# EAGLE design hexapod_mk2_main_v2.0 (EAGLE 9.6.2)
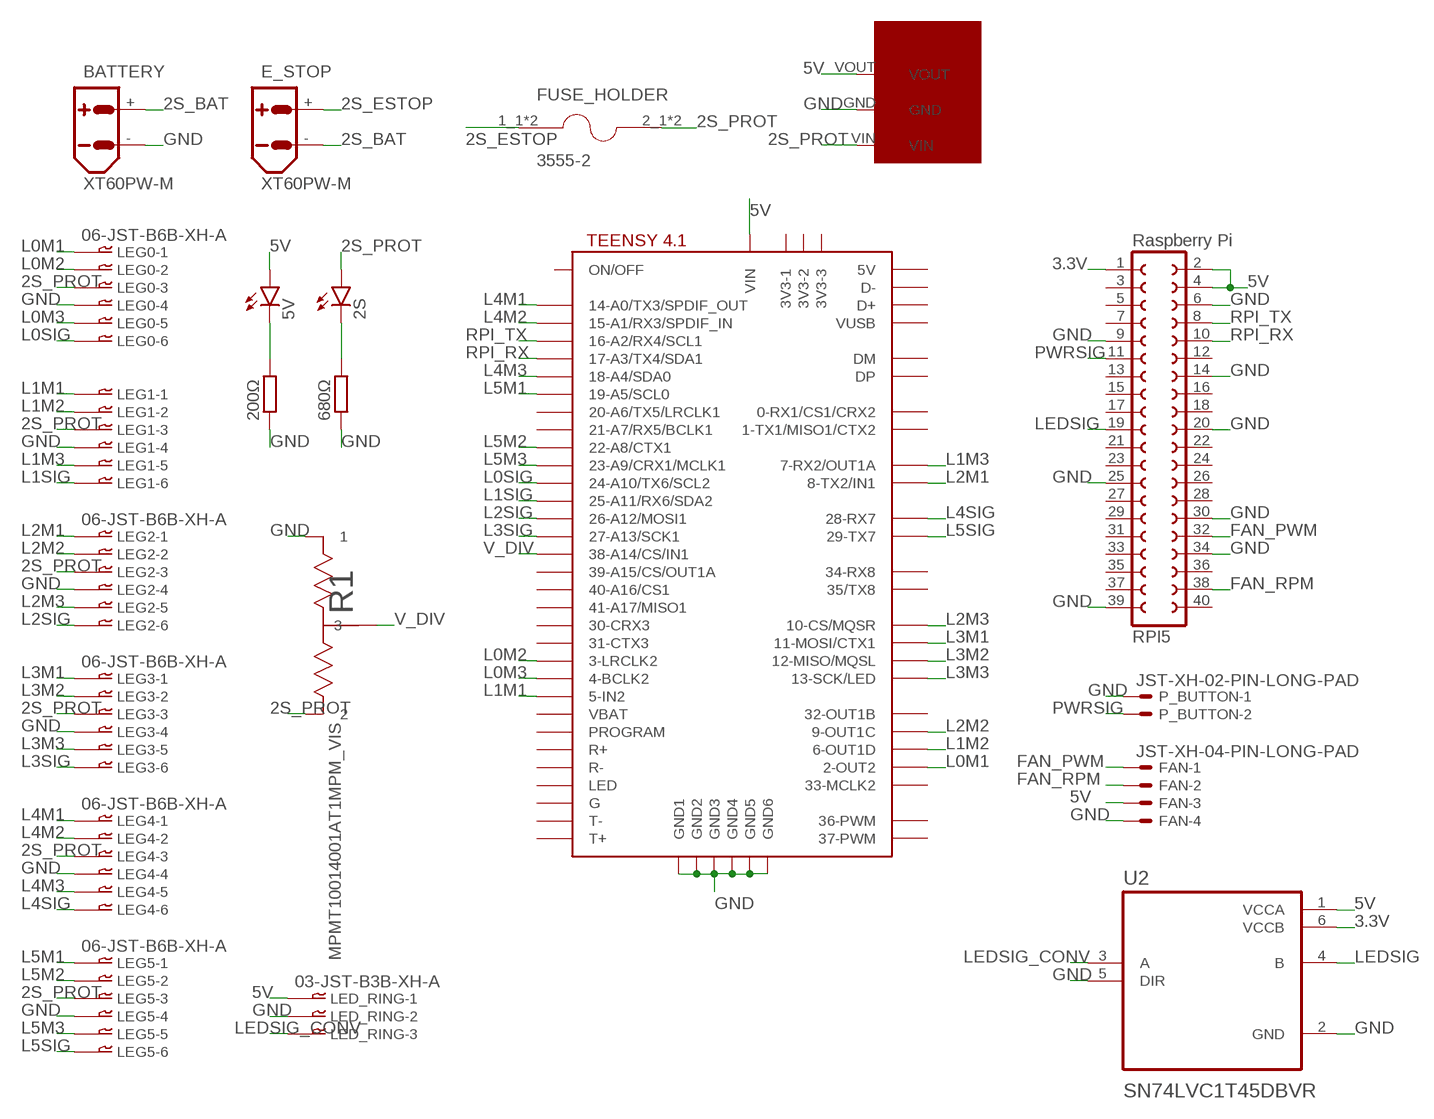
[diagram p0: schematic, sheet 1]

## Parts
2S  LEDCHIPLED_0805  [CHIPLED_0805]
5V  LEDCHIPLED_0805  [CHIPLED_0805]
200Ω  R-EU_R0805  [R0805]
680Ω  R-EU_R0805  [R0805]
BATTERY  XT60PW-M  [XT60PW-M]
DFR0753  DFR0753  [DFR0753]
E_STOP  XT60PW-M  [XT60PW-M]
FAN  JST-XH-04-PIN-LONG-PAD  [JST-XH-04-PACKAGE-LONG-PAD]
FUSE_HOLDER  3555-2  [FUSE_3555-2]
LED_RING  03-JST-B3B-XH-A  [B3B-XH]
LEG0  06-JST-B6B-XH-A  [B6B-XH]
LEG1  06-JST-B6B-XH-A  [B6B-XH]
LEG2  06-JST-B6B-XH-A  [B6B-XH]
LEG3  06-JST-B6B-XH-A  [B6B-XH]
LEG4  06-JST-B6B-XH-A  [B6B-XH]
LEG5  06-JST-B6B-XH-A  [B6B-XH]
P_BUTTON  JST-XH-02-PIN-LONG-PAD  [JST-XH-02-PACKAGE-LONG-PAD]
R1  MPMT10014001AT1MPM_VIS  [MPM_VIS]
RPI5  Raspberry Pi  FE20-2  [FE20-2]
U2  SN74LVC1T45DBVR  [SOT95P280X145-6N]
U$1  TEENSY41  [TEENSY41]

## Nets
2S_BAT: BATTERY.+ E_STOP.-
2S_ESTOP: E_STOP.+ FUSE_HOLDER.1_1 FUSE_HOLDER.1_2
2S_PROT: 2S.A DFR0753.VIN FUSE_HOLDER.2_1 FUSE_HOLDER.2_2 LEG0.P$3 LEG1.P$3 LEG2.P$3 LEG3.P$3 LEG4.P$3 LEG5.P$3 R1.2
3.3V: RPI5.1 U2.6(VCCB)
5V: 5V.A DFR0753.VOUT FAN.3 LED_RING.P$1 RPI5.2 RPI5.4 U2.1(VCCA) U$1.VIN
FAN_PWM: FAN.1 RPI5.32
FAN_RPM: FAN.2 RPI5.38
GND: 200Ω.1 680Ω.1 BATTERY.- DFR0753.GND FAN.4 LED_RING.P$2 LEG0.P$4 LEG1.P$4 LEG2.P$4 LEG3.P$4 LEG4.P$4 LEG5.P$4 P_BUTTON.1 R1.1 RPI5.6 RPI5.9 RPI5.14 RPI5.20 RPI5.25 RPI5.30 RPI5.34 RPI5.39 U2.2(GND) U2.5(DIR) U$1.GND1 U$1.GND2 U$1.GND3 U$1.GND4 U$1.GND5 U$1.GND6
L0M1: LEG0.P$1 U$1.2-OUT2
L0M2: LEG0.P$2 U$1.3-LRCLK2
L0M3: LEG0.P$5 U$1.4-BCLK2
L0SIG: LEG0.P$6 U$1.24-A10/TX6/SCL2
L1M1: LEG1.P$1 U$1.5-IN2
L1M2: LEG1.P$2 U$1.6-OUT1D
L1M3: LEG1.P$5 U$1.7-RX2/OUT1A
L1SIG: LEG1.P$6 U$1.25-A11/RX6/SDA2
L2M1: LEG2.P$1 U$1.8-TX2/IN2(8-TX2/IN1)
L2M2: LEG2.P$2 U$1.9-OUT1C
L2M3: LEG2.P$5 U$1.10-CS\MQSR(10-CS/MQSR)
L2SIG: LEG2.P$6 U$1.26-A12/MOSI1
L3M1: LEG3.P$1 U$1.11-MOSI/CTX1
L3M2: LEG3.P$2 U$1.12-MISO/MQSL
L3M3: LEG3.P$5 U$1.13-SCK/LED
L3SIG: LEG3.P$6 U$1.27-A13/SCK1
L4M1: LEG4.P$1 U$1.14-A0/TX3/SPDIF_OUT
L4M2: LEG4.P$2 U$1.15-A1/RX3/SPDIF_IN
L4M3: LEG4.P$5 U$1.18-A4/SDA0
L4SIG: LEG4.P$6 U$1.28-RX7
L5M1: LEG5.P$1 U$1.19-A5/SCL0
L5M2: LEG5.P$2 U$1.22-A8/CTX1
L5M3: LEG5.P$5 U$1.23-A9/CRX1/MCLK1
L5SIG: LEG5.P$6 U$1.29-TX7
LEDSIG: RPI5.19 U2.4(B)
LEDSIG_CONV: LED_RING.P$3 U2.3(A)
N$1: 5V.C 200Ω.2
N$2: 2S.C 680Ω.2
PWRSIG: P_BUTTON.2 RPI5.11
RPI_RX: RPI5.10 U$1.17-A3/TX4/SDA1
RPI_TX: RPI5.8 U$1.16-A2/RX4/SCL1
V_DIV: R1.3 U$1.38-A14/CS/IN1
Unconnected: RPI5.3 RPI5.5 RPI5.7 RPI5.12 RPI5.13 RPI5.15 RPI5.16 RPI5.17 RPI5.18 RPI5.21 RPI5.22 RPI5.23 RPI5.24 RPI5.26 RPI5.27 RPI5.28 RPI5.29 RPI5.31 RPI5.33 RPI5.35 RPI5.36 RPI5.37 RPI5.40 U$1.0-RX1/CS1/CRX2 U$1.1-TX1/MISO1/CTX2 U$1.3V3-1 U$1.3V3-2 U$1.3V3-3 U$1.20-A6/TX5/LRCLK1 U$1.21-A7/RX5/BCLK1 U$1.30-CRX3 U$1.31-CTX3 U$1.32-OUT1B U$1.33-MCLK2 U$1.34-RX8 U$1.35-TX8(35/TX8) U$1.36-PWM U$1.37-PWM U$1.39-A15/CS/OUT1A U$1.40-A16/CS1 U$1.41-A17/MISO1 U$1.+5V(5V) U$1.D+ U$1.D- U$1.DM U$1.DP U$1.G U$1.LED U$1.ON/OFF U$1.PROGRAM U$1.R+ U$1.R- U$1.T+ U$1.T- U$1.VBAT U$1.VUSB

## Library data of the parts
2S 5V = led:LED: LED OSRAM: - CHIPLED LG R971, LG N971, LY N971, LG Q971, LY Q971, LO R971, LY R971 LH N974, LH R974 LS Q976, LO Q976, LY Q976 LO Q996 - Hyper CHIPLED LW Q18S LB Q993, LB Q99A, LB R99A - SideLED LS A670, LO A670, LY A670, LG A670, LP A670 LB A673, LV A673, LT A673, LW A673 LH A674 LY A675 LS A676, LA A676, LO A676, LY A676, LW A676 LS A679, LY A679, LG A679 - Hyper Micro SIDELED® LS Y876, LA Y876, LO Y876, LY Y876 LT Y87S - SmartLED LW L88C, LW L88S LB L89C, LB L89S, LG L890 LS L89K, LO L89K, LY L89K LS L896, LA L896, LO L896, LY L896 - TOPLED LS T670, LO T670, LY T670, LG T670, LP T670 LSG T670, LSP T670, LSY T670, LOP T670, LYG T670 LG T671, LOG T671, LSG T671 LB T673, LV T673, LT T673, LW T673 LH T674 LS T676, LA T676, LO T676, LY T676, LB T676, LH T676, LSB T676, LW T676 LB T67C, LV T67C, LT T67C, LS T67K, LO T67K, LY T67K, LW E67C LS E67B, LA E67B, LO E67B, LY E67B, LB E67C, LV E67C, LT E67C LW T67C LS T679, LY T679, LG T679 LS T770, LO T770, LY T770, LG T770, LP T770 LB T773, LV T773, LT T773, LW T773 LH T774 LS E675, LA E675, LY E675, LS T675 LS T776, LA T776, LO T776, LY T776, LB T776 LHGB T686 LT T68C, LB T68C - Hyper Mini TOPLED® LB M676 - Mini TOPLED Santana® LG M470 LS M47K, LO M47K, LY M47K Source: http://www.osram.convergy.de LUXEON: - LUMILED® LXK2-PW12-R00, LXK2-PW12-S00, LXK2-PW14-U00, LXK2-PW14-V00 LXK2-PM12-R00, LXK2-PM12-S00, LXK2-PM14-U00 LXK2-PE12-Q00, LXK2-PE12-R00, LXK2-PE12-S00, LXK2-PE14-T00, LXK2-PE14-U00 LXK2-PB12-K00, LXK2-PB12-L00, LXK2-PB12-M00, LXK2-PB14-N00, LXK2-PB14-P00, LXK2-PB14-Q00 LXK2-PR12-L00, LXK2-PR12-M00, LXK2-PR14-Q00, LXK2-PR14-R00 LXK2-PD12-Q00, LXK2-PD12-R00, LXK2-PD12-S00 LXK2-PH12-R00, LXK2-PH12-S00 LXK2-PL12-P00, LXK2-PL12-Q00, LXK2-PL12-R00 Source: www.luxeon.com KINGBRIGHT: KA-3528ASYC Source: www.kingbright.com
200Ω 680Ω = rcl:R-EU_: RESISTOR, European symbol; SPICEPREFIX: R
BATTERY E_STOP = amass:XT60: AMASS XT60 connector Store in Japan AMASS XT60 connector <https://szc.jp/ams-xt60>
DFR0753 = DFR0753:DFR0753
FAN = Rembrandt Electronics - JST XH Connectors v1-0:JST-XH-04-PIN: JST XH Connector 2 Pin Wire to board connector. Pitch: 2,54 mm, (0.100") Number of pins: 4 Created by Rembrandt Electronics www.rembrandtelectronics.com
FUSE_HOLDER = 3555-2:3555-2; MANUFACTURER: Keystone; MAXIMUM_PACKAGE_HEIGHT: 11.6mm; PARTREV: A; SNAPEDA_PN: 3555-2; STANDARD: Manufacturer Recommendations
LED_RING = bt_con-jst-xh:03-JST: JST CONNECTOR
LEG0 LEG1-LEG5 = bt_con-jst-xh:06-JST: JST CONNECTOR
P_BUTTON = Rembrandt Electronics - JST XH Connectors v1-0:JST-XH-02-PIN: JST XH Connector 2 Pin Wire to board connector. Pitch: 2,54 mm, (0.100") Number of pins: 2 Created by Rembrandt Electronics www.rembrandtelectronics.com
R1 = MPMT10014001AT1:MPMT10014001AT1; COPYRIGHT: Copyright (C) 2024 Ultra Librarian. All rights reserved.; MANUFACTURER_PART_NUMBER: MPMT10014001AT1; MFR_NAME: Vishay
RPI5 = con-lsta:FE20-2: FEMALE HEADER; OC_FARNELL: unknown; OC_NEWARK: unknown
U2 = SN74LVC1T45DBVR:SN74LVC1T45DBVR
U$1 = teensy:TEENSY41

## Module RASPBERRYPI_PINOUT
Ports: 

### Library data of the parts

## Net classes
0 default: clearance 0.205 mm

## Board
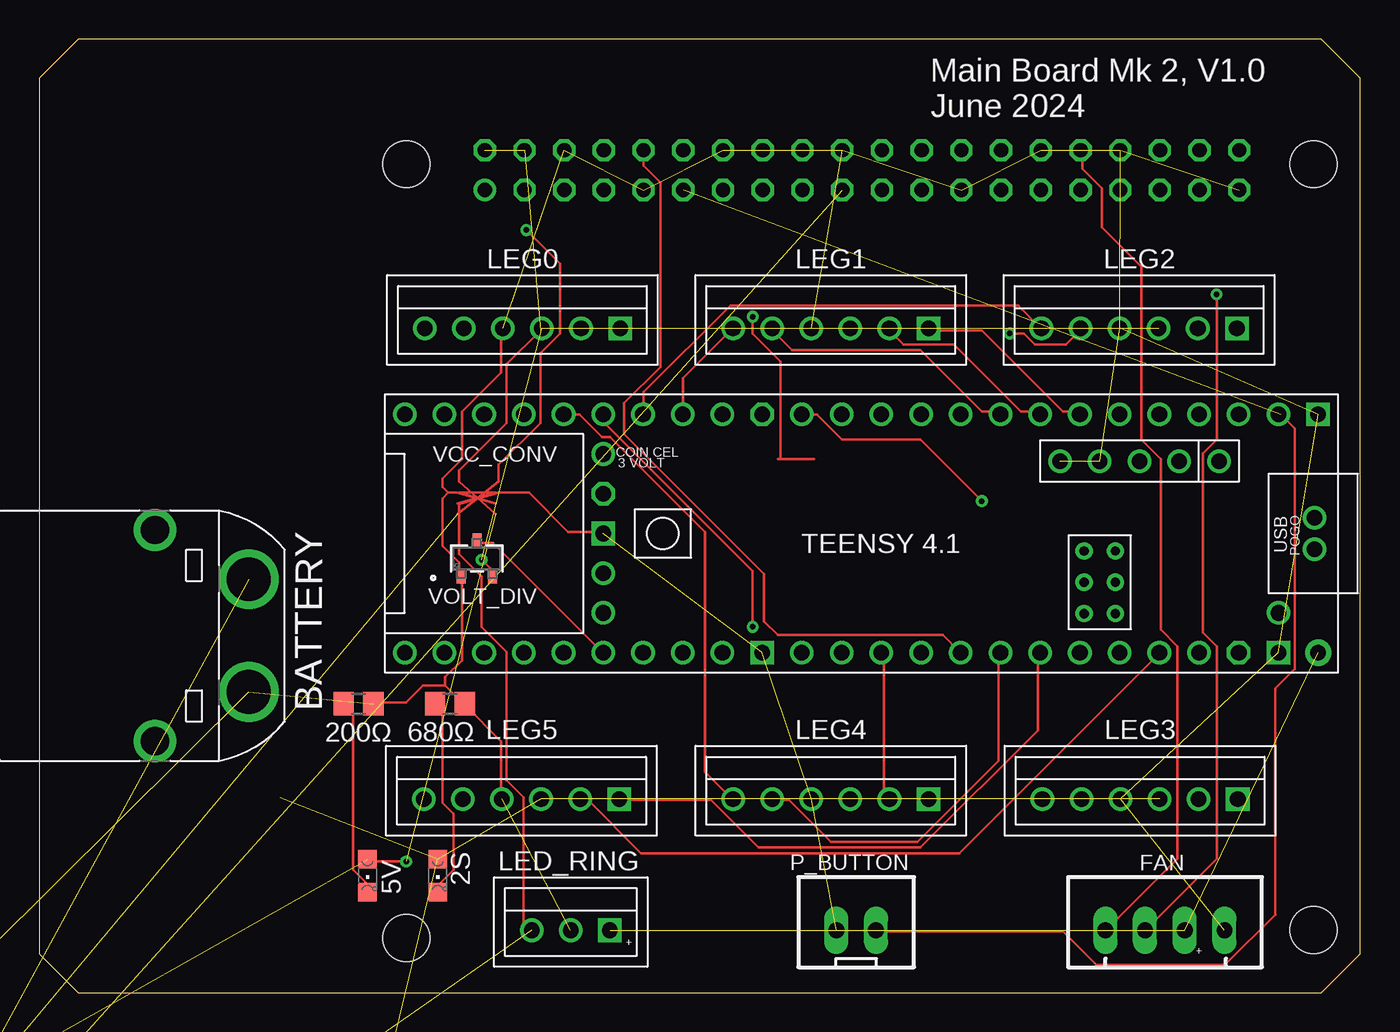
[diagram p1: board, top side]
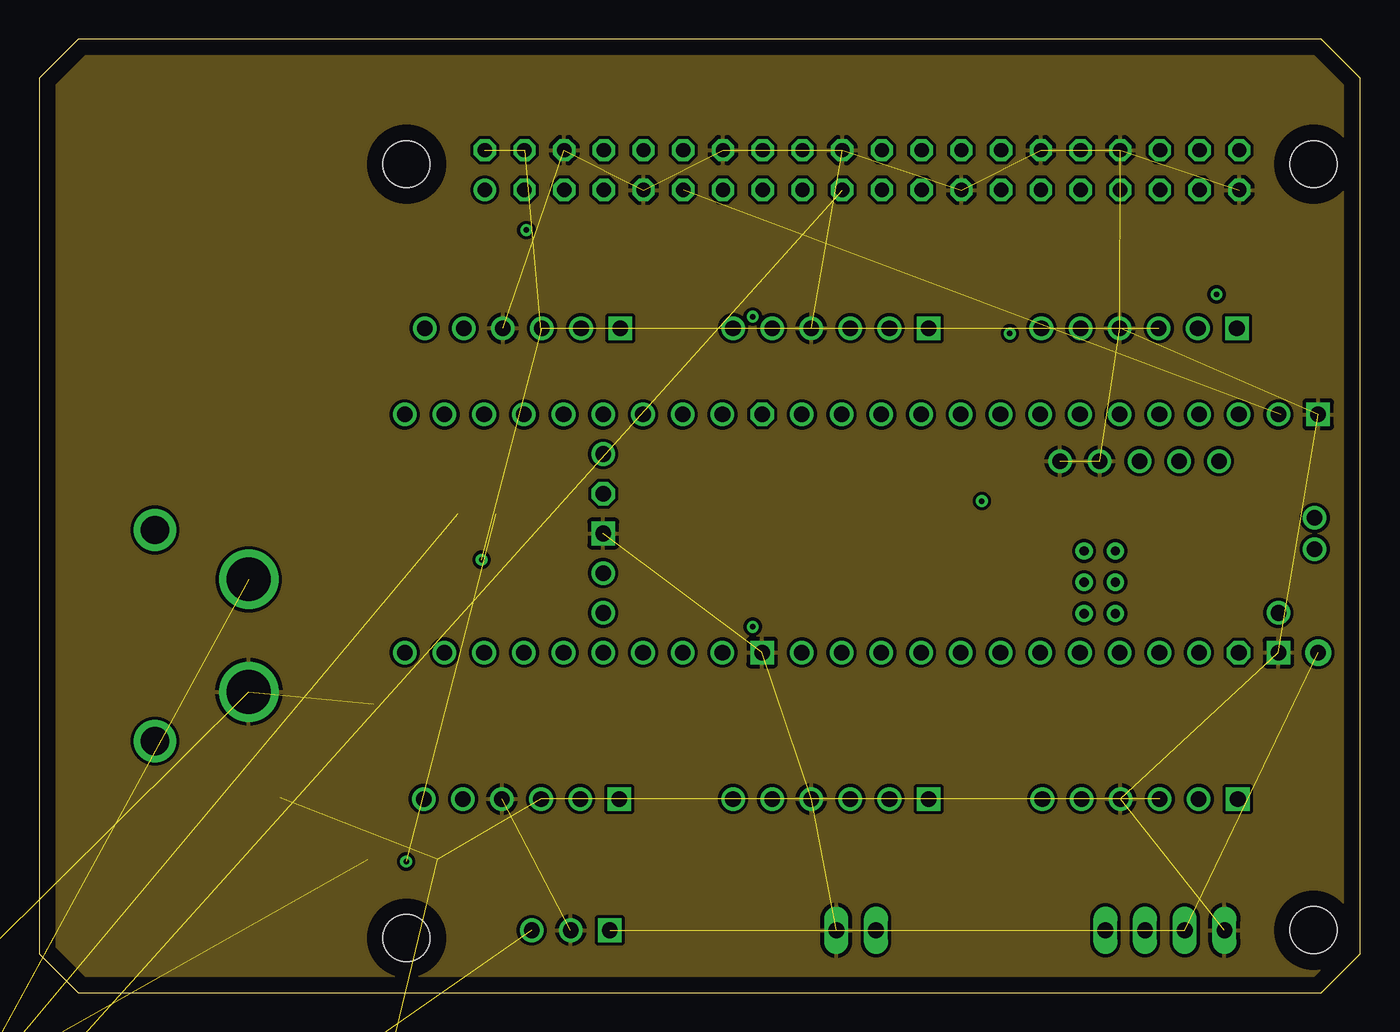
[diagram p2: board, inner layer Route2]
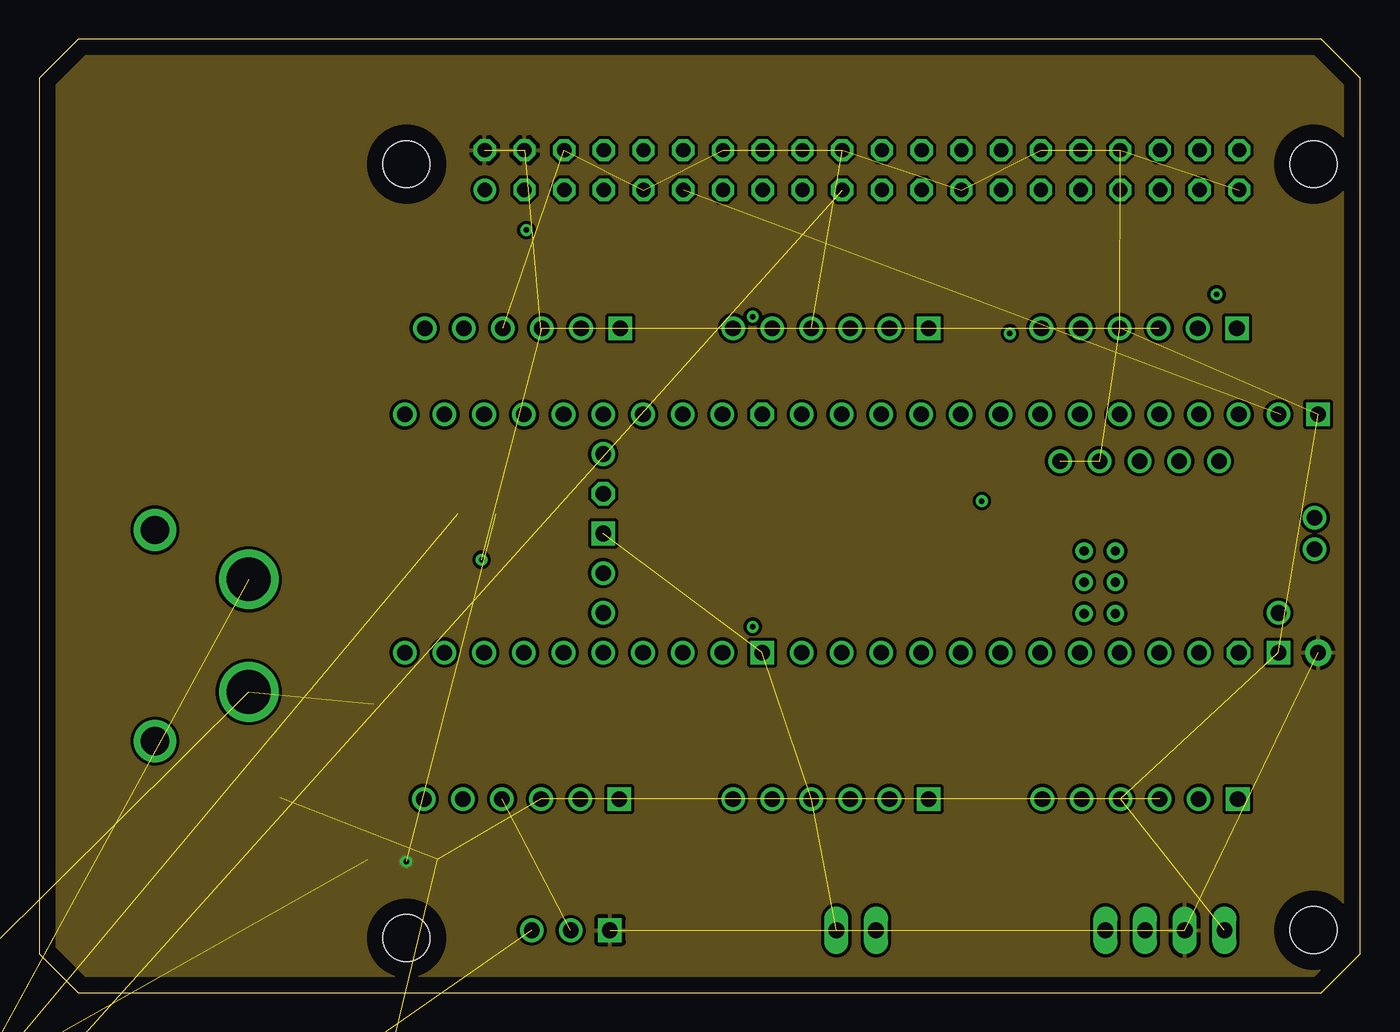
[diagram p3: board, inner layer Route15]
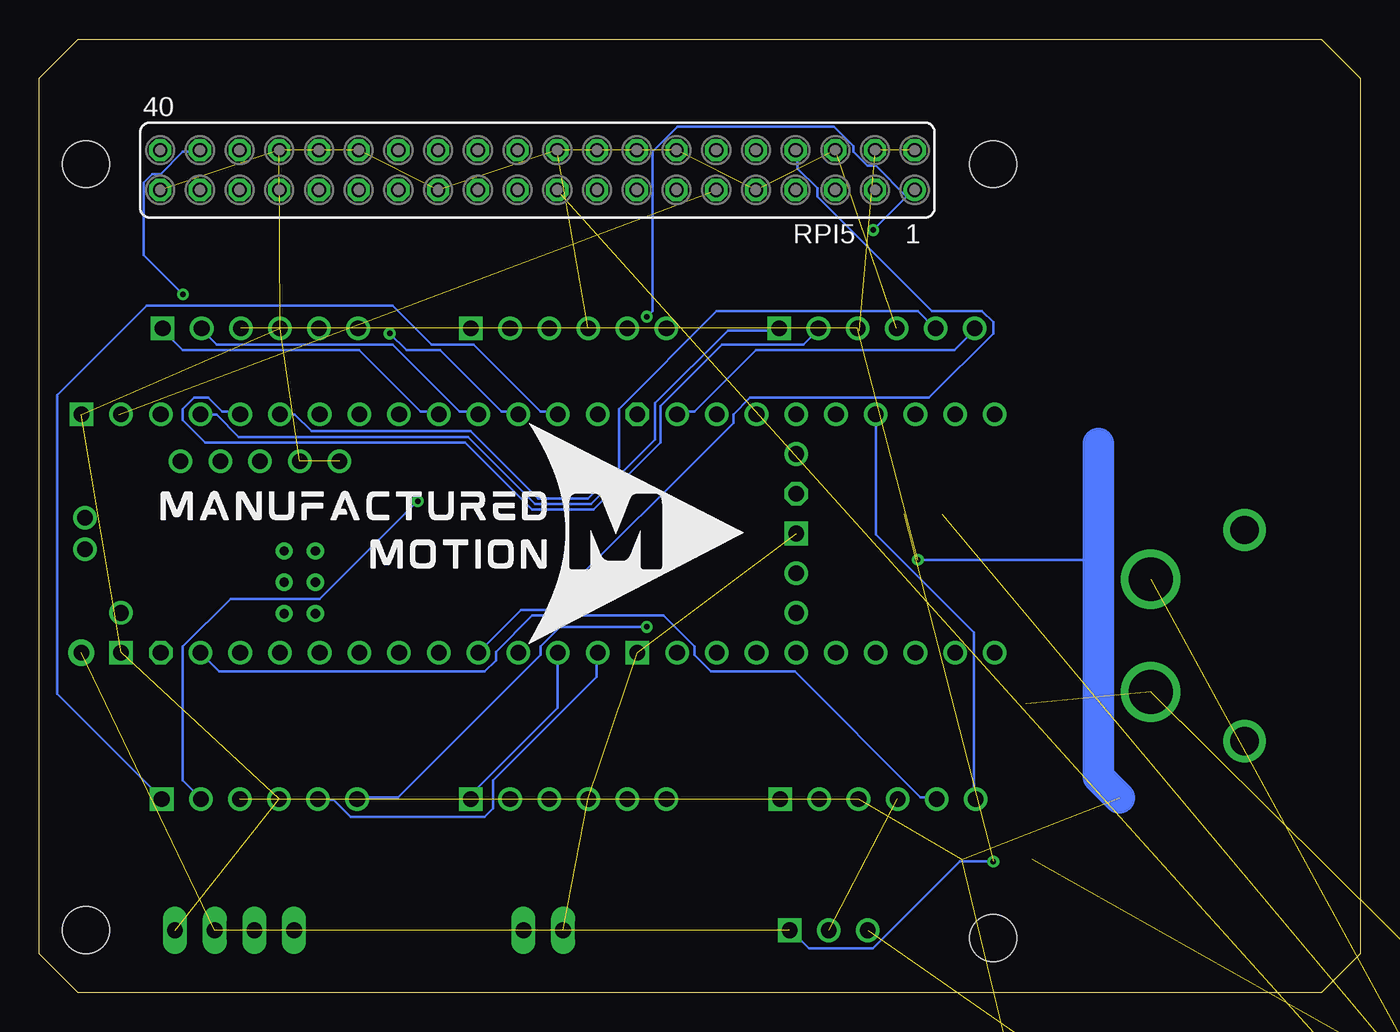
[diagram p4: board, bottom side, seen from below]

Size 84.5 x 61 mm. Coordinates in mm from the lower left corner, seen from the top.
Outline: 0,58.5 0,2.5 2.5,0 82,0 84.5,2.5 84.5,58.5 82,61 2.5,61 0,58.5
Copper layers (1+2*15+16): Top 0.035mm / dielectric 1.5mm / Route2 0.035mm / dielectric 0.15mm / Route15 0.035mm / dielectric 0.2mm / Bottom 0.035mm
Design rules "default *": minimum track width 6mil, minimum drill 0.35mm, track to track 6mil, track to pad 6mil, pad to pad 6mil, via to via 6mil, smd to smd 6mil, copper to edge 40mil, drill to drill 6mil, minimum pad ring 10mil, minimum via ring 8mil, stop-mask expansion 4mil, vias tented up to drill 0mil, thermal gap 10mil
Holes 3 mm at 23.5,53 23.5,3.5 81.5,53 81.5,4

### Footprints (pad centres in the part's own frame; a part is rotated, then mirrored left to right if it is on the bottom)
CHIPLED_0805 = smd 1.2 x 1.2: A 0,-1.05; C 0,1.05
R0805 = smd 1.3 x 1.5: 1 -0.95,0; 2 0.95,0
XT60PW-M = drill 2.8: + 3.6,0; - -3.6,0 | drill 1.8: P$3 -6.75,6; P$4 6.75,6
DFR0753 = smd 2.54 x 2.54: ANCHOR 9,10; VIN -8.5,-10; VOUT -8.5,2.5 | smd 2.54 x 5.08: GND -8.5,-3.75
JST-XH-04-PACKAGE-LONG-PAD = drill 1.016 long: 1 -3.81,0; 2 -1.27,0; 3 1.27,0; 4 3.81,0
FUSE_3555-2 = drill 4.09 pad 5.59: 1_1 -14.685,0; 1_2 -6.355,0; 2_1 6.345,0; 2_2 14.675,0
B3B-XH = drill 1 square: P$1 2.5,0 | drill 1: P$2 0,0; P$3 -2.5,0
B6B-XH = drill 1 square: P$1 6.25,0 | drill 1: P$2 3.75,0; P$3 1.25,0; P$4 -1.25,0; P$5 -3.75,0; P$6 -6.25,0
JST-XH-02-PACKAGE-LONG-PAD = drill 1.016 long: 1 -1.27,0; 2 1.27,0
MPM_VIS = smd 0.584 x 0.965: 1 -1.003,-1.118; 2 1.003,-1.118; 3 0,1.118
FE20-2 = drill 0.914: 1 -24.13,1.27 | drill 0.914 octagon: 2 -24.13,-1.27; 3 -21.59,1.27; 4 -21.59,-1.27; 5 -19.05,1.27; 6 -19.05,-1.27; 7 -16.51,1.27; 8 -16.51,-1.27; 9 -13.97,1.27; 10 -13.97,-1.27; 11 -11.43,1.27; 12 -11.43,-1.27; 13 -8.89,1.27; 14 -8.89,-1.27; 15 -6.35,1.27; 16 -6.35,-1.27; 17 -3.81,1.27; 18 -3.81,-1.27; 19 -1.27,1.27; 20 -1.27,-1.27; 21 1.27,1.27; 22 1.27,-1.27; 23 3.81,1.27; 24 3.81,-1.27; 25 6.35,1.27; 26 6.35,-1.27; 27 8.89,1.27; 28 8.89,-1.27; 29 11.43,1.27; 30 11.43,-1.27; 31 13.97,1.27; 32 13.97,-1.27; 33 16.51,1.27; 34 16.51,-1.27; 35 19.05,1.27; 36 19.05,-1.27; 37 21.59,1.27; 38 21.59,-1.27; 39 24.13,1.27; 40 24.13,-1.27
SOT95P280X145-6N = smd 1.21 x 0.58: 1 -1.255,0.95; 2 -1.255,0; 3 -1.255,-0.95; 4 1.255,-0.95; 5 1.255,0; 6 1.255,0.95
TEENSY41 = drill 1: 0-RX1/CS1/CRX2 -27.94,-7.62; 1-TX1/MISO1/CTX2 -25.4,-7.62; 2-OUT2 -22.86,-7.62; 3-LRCLK2 -20.32,-7.62; 4-BCLK2 -17.78,-7.62; 5-IN2 -15.24,-7.62; 6-OUT1D -12.7,-7.62; 7-RX2/OUT1A -10.16,-7.62; 8-TX2/IN2 -7.62,-7.62; 9-OUT1C -5.08,-7.62; 10-CS\MQSR -2.54,-7.62; 11-MOSI/CTX1 0,-7.62; 12-MISO/MQSL 2.54,-7.62; 13-SCK/LED 2.54,7.62; 14-A0/TX3/SPDIF_OUT 0,7.62; 15-A1/RX3/SPDIF_IN -2.54,7.62; 16-A2/RX4/SCL1 -5.08,7.62; 17-A3/TX4/SDA1 -7.62,7.62; 18-A4/SDA0 -10.16,7.62; 19-A5/SCL0 -12.7,7.62; 20-A6/TX5/LRCLK1 -15.24,7.62; 21-A7/RX5/BCLK1 -17.78,7.62; 22-A8/CTX1 -20.32,7.62; 23-A9/CRX1/MCLK1 -22.86,7.62; 24-A10/TX6/SCL2 7.62,-7.62; 25-A11/RX6/SDA2 10.16,-7.62; 26-A12/MOSI1 12.7,-7.62; 27-A13/SCK1 15.24,-7.62; 28-RX7 17.78,-7.62; 29-TX7 20.32,-7.62; 30-CRX3 22.86,-7.62; 31-CTX3 25.4,-7.62; 32-OUT1B 27.94,-7.62; 33-MCLK2 27.94,7.62; 34-RX8 25.4,7.62; 35-TX8 22.86,7.62; 36-PWM 20.32,7.62; 37-PWM 17.78,7.62; 38-A14/CS/IN1 15.24,7.62; 39-A15/CS/OUT1A 12.7,7.62; 40-A16/CS1 10.16,7.62; 41-A17/MISO1 7.62,7.62; +5V -24.13,-4.62; D+ -30.25,-1; D- -30.25,1; DM -21.59,-4.62; DP -19.05,-4.62; GND4 -16.51,-4.62; GND5 -13.97,-4.62; ON/OFF 15.24,5.08; PROGRAM 15.24,2.54; VBAT 15.24,-5.08; VUSB -27.94,5.08 | drill 1 octagon: 3V3-1 5.08,-7.62; 3V3-2 15.24,-2.54; 3V3-3 -25.4,7.62 | drill 0.6: G -15.51,3.12; LED -17.51,3.12; R+ -17.51,5.12; R- -15.51,5.12; T+ -15.51,1.12; T- -17.51,1.12 | drill 1 square: GND1 -30.48,-7.62; GND2 15.24,0; GND3 5.08,7.62; GND6 -27.94,7.62 | drill 1 pad 1.676: VIN -30.48,7.62

### Placement (x,y rotation side)
2S  25.5,7.5 180 top
5V  21,7.5 180 top
200Ω  20.43,18.48 180 top
680Ω  26.28,18.48 180 top
BATTERY  13.41,22.85 90 top
DFR0753  -27.82,-26.32 0 top  (outside the outline)
E_STOP  -9.21,-21.58 0 top  (outside the outline)
FAN  72,4 0 top
FUSE_HOLDER  1.08,-32.01 0 top  (outside the outline)
LED_RING  34,4 0 top
LEG0  30.91,42.51 0 top
LEG1  50.63,42.51 0 top
LEG2  70.35,42.51 0 top
LEG3  70.41,12.4 0 top
LEG4  50.63,12.4 0 top
LEG5  30.85,12.4 0 top
P_BUTTON  52.25,4 0 top
R1  28,27.79 0 top
RPI5  52.63,52.62 180 bottom
U2  -34.28,-41.73 0 top  (outside the outline)
U$1  51.32,29.38 180 top

### Tracks (layer width: path | path; a pad name or v marks a point on that pad's centre or on a via)
2S_BAT  (1 unrouted)
2S_ESTOP  (2 unrouted)
2S_PROT  (via drill 0.35)  (10 unrouted)
  Top 0.152: v28.3,27.7 28.84,27.16 28.84,26.8 R1.2
  Bottom 0.152: 16.75,27.7 v28.3,27.7
  Bottom 2: 15.41,12.46 16.75,13.81 16.75,27.7 16.75,35.14
3.3V  (via drill 0.35)  (1 unrouted)
  Top 0.152: v31.16,48.78 33.31,46.64 33.31,42.17 32.06,40.92 32.06,36.45 29.38,33.77 29.38,32.7 26.76,30.63 | 49.57,34.13 47.42,34.13 | 47.42,34.13 47.24,34.13 | v45.64,43.24 45.64,42.17 47.42,40.39 47.42,34.13
  Bottom 0.152: 29.02,50.93 28.66,51.29 RPI5.1 29.02,50.93 | 29.02,50.93 v31.16,48.78 | 29.02,50.93 30.98,52.9 31.52,52.9 32.41,53.79 32.41,54.15 33.66,55.4 43.67,55.4 45.28,53.79 45.28,43.6 v45.64,43.24
5V  (via drill 0.35)  (7 unrouted)
  Top 0.152: 32.06,42.35 29.91,40.21 29.91,36.45 26.87,33.42 26.87,32.7 29.18,30.63 | v23.48,8.4 21.16,8.4 5V.A
  Bottom 0.152: v23.48,8.4 25.62,8.4 31.16,2.86 35.27,2.86 36.34,3.93 LED_RING.P$1
  pour Route15: -1.94,59.12 1.65,62.71 81.77,62.71 82,62.48 86.48,57.99 86.48,57.66 86.48,2.57 83.01,-0.9 1.75,-0.9 -1.72,2.57 -1.94,2.79
FAN_PWM
  Top 0.152: RPI5.32 66.72,53.79 66.72,52.72 67.97,51.47 67.97,48.96 70.48,46.46 70.48,35.38 71.73,34.13 71.73,23.23 72.8,22.16 72.8,8.58 68.33,4.11 FAN.1
FAN_RPM  (via drill 0.35)
  Top 0.152: v75.3,44.67 75.3,35.38 74.41,34.49 74.41,23.05 75.3,22.16 75.3,8.58 70.83,4.11 FAN.2
  Bottom 0.152: v75.3,44.67 77.8,47.18 77.8,51.82 77.27,52.36 76.73,52.36 75.3,53.79 74.23,53.79 RPI5.38
GND  (24 unrouted)
  Top 0.152: 25.98,19.66 24.55,19.66 23.48,18.59 21.51,18.59 200Ω.1 | 25.98,19.66 27.05,18.59 680Ω.1 27.23,18.41 29.55,16.08 29.55,12.51 LEG5.P$4 | 26.16,31.99 25.8,31.63 25.8,28.59 26.87,27.52 26.87,26.8 R1.1 27.05,26.63 27.05,21.27 25.98,20.19 25.98,19.66 | 26.16,31.99 26.7,31.99 29.18,31.28 26.87,31.99 29.2,31.99 26.76,31.28 29.38,31.99 31.34,31.99 33.84,29.48 35.99,29.48 U$1.GND2 | 26.16,31.99 25.8,32.34 25.8,32.88 27.05,34.13 27.05,37.17 29.55,39.67 29.55,42.4 LEG0.P$4
  pour Route2: -17.35,54.16 -7.1,64.4 89.5,64.4 89.5,-1.17 88.03,-2.64 1.39,-2.64 -9.65,8.4 -17.35,16.09
L0M1
  Bottom 0.152: U$1.2-OUT2 74.05,36.99 73.16,36.99 71.73,35.56 57.07,35.56 52.78,31.27 49.21,31.27 45.1,35.38 45.1,37.71 40.45,42.35 37.24,42.35 LEG0.P$1
L0M2
  Bottom 0.152: U$1.3-LRCLK2 71.73,37.17 72.8,37.17 73.69,38.06 74.59,38.06 75.3,37.35 75.3,36.63 73.87,35.2 57.25,35.2 52.96,30.91 49.03,30.91 44.74,35.2 44.74,37.53 40.81,41.46 35.63,41.46 34.74,42.35 LEG0.P$2
L0M3
  Bottom 0.152: U$1.4-BCLK2 69.05,36.99 68.15,36.99 67.08,35.92 56.9,35.92 52.61,31.63 49.39,31.63 47.42,33.6 47.42,37.35 41.17,43.6 28.3,43.6 27.23,42.53 LEG0.P$5
L0SIG
  Bottom 0.152: U$1.24-A10/TX6/SCL2 43.67,37.17 42.6,37.17 38.67,41.1 25.98,41.1 24.73,42.35 LEG0.P$6
L1M1
  Top 0.152: U$1.5-IN2 66.55,37.17 65.47,37.17 60.29,42.35 56.9,42.35 LEG1.P$1
L1M2
  Top 0.152: U$1.6-OUT1D 63.86,37.17 62.79,37.17 58.5,41.46 55.29,41.46 54.39,42.35 LEG1.P$2
L1M3
  Top 0.152: U$1.7-RX2/OUT1A 61.36,37.17 60.29,37.17 56.36,41.1 48.14,41.1 46.89,42.35 LEG1.P$5
L1SIG
  Top 0.152: U$1.25-A11/RX6/SDA2 41.17,37.17 41.17,39.31 44.21,42.35 LEG1.P$6
L2M1
  Bottom 0.152: U$1.8-TX2/IN2 59.04,37.17 60.11,37.17 64.04,41.1 75.3,41.1 76.55,42.35 LEG2.P$1
L2M2
  Bottom 0.152: U$1.9-OUT1C 56.54,37.17 57.61,37.17 61.9,41.46 73.16,41.46 74.05,42.35 LEG2.P$2
L2M3  (via drill 0.35)
  Top 0.152: v62.08,42.17 62.97,42.17 63.69,41.46 65.65,41.46 66.55,42.35 LEG2.P$5
  Bottom 0.152: v62.08,42.17 61.01,41.1 58.86,41.1 54.93,37.17 54.04,37.17 U$1.10-CS\MQSR
L2SIG
  Top 0.152: U$1.26-A12/MOSI1 38.67,37.17 38.67,38.42 44.21,43.96 62.61,43.96 64.04,42.53 LEG2.P$6
L3M1
  Bottom 0.152: U$1.11-MOSI/CTX1 51.35,37.17 52.43,37.17 56.72,41.46 59.4,41.46 61.9,43.96 77.62,43.96 83.34,38.24 83.34,19.12 76.73,12.51 LEG3.P$1
L3M2  (via drill 0.35)
  Top 0.152: v60.29,31.45 56.36,35.38 51.35,35.38 49.75,36.99 48.85,36.99 U$1.12-MISO/MQSL
  Bottom 0.152: v60.29,31.45 66.55,25.2 72.26,25.2 75.3,22.16 75.3,13.58 74.23,12.51 LEG3.P$2
L3M3
  Bottom 0.152: LEG3.P$5 66.55,12.33 65.65,12.33 64.58,11.26 56,11.26 55.47,11.79 55.47,13.58 48.85,20.19 48.85,21.62 U$1.13-SCK/LED
L3SIG  (via drill 0.35)
  Top 0.152: v45.64,23.41 45.64,26.98 36.17,36.45 36.17,36.99 U$1.27-A13/SCK1
  Bottom 0.152: v45.64,23.41 51.18,23.41 52.43,22.16 52.43,21.62 61.54,12.51 64.04,12.51 LEG3.P$6
L4M1
  Bottom 0.152: U$1.14-A0/TX3/SPDIF_OUT 51.35,21.62 51.35,18.23 56.72,12.87 56.72,12.51 LEG4.P$1
L4M2
  Top 0.152: U$1.15-A1/RX3/SPDIF_IN 54.04,21.62 54.04,12.69 54.22,12.51 LEG4.P$2
L4M3
  Top 0.152: LEG4.P$5 46.89,12.33 47.96,12.33 50.64,9.65 56.18,9.65 61.36,14.83 61.36,21.62 U$1.18-A4/SDA0
L4SIG
  Top 0.152: U$1.28-RX7 33.66,36.99 34.56,36.99 35.99,35.56 36.52,35.56 42.6,29.48 42.6,14.12 44.21,12.51 LEG4.P$6
L5M1
  Top 0.152: LEG5.P$1 37.24,12.33 42.96,12.33 45.99,9.29 56.36,9.29 63.86,16.8 63.86,21.62 U$1.19-A5/SCL0
L5M2
  Top 0.152: LEG5.P$2 34.74,12.33 35.09,12.33 38.49,8.94 58.86,8.94 71.55,21.62 U$1.22-A8/CTX1
L5M3
  Bottom 0.152: LEG5.P$5 27.23,12.51 28.12,12.51 36.17,20.55 41.53,20.55 42.6,21.62 42.6,22.16 44.56,24.12 52.96,24.12 55.29,21.8 55.29,21.27 56,20.55 72.98,20.55 74.05,21.62 U$1.23-A9/CRX1/MCLK1
L5SIG
  Bottom 0.152: LEG5.P$6 24.73,12.51 24.73,23.05 30.98,29.31 30.98,36.99 U$1.29-TX7
LEDSIG  (1 unrouted)
LEDSIG_CONV  (1 unrouted)
  Top 0.152: 29.18,31.93 26.87,31.27 26.87,28.06 28.3,26.63 28.3,23.41 29.91,21.8 29.91,13.58 30.98,12.51 30.98,4.47 31.34,4.11 LED_RING.P$3
N$1
  Top 0.152: 5V.C 20.98,6.61 20.98,6.97 20.08,7.86 20.08,17.87 19.55,18.41 200Ω.2
N$2
  Top 0.152: 2S.C 25.62,6.61 25.62,6.97 26.52,7.86 26.52,11.44 25.8,12.15 25.8,18.05 25.44,18.41 680Ω.2
PWRSIG  (1 unrouted)
  Top 0.152: 79.41,36.99 80.31,36.1 80.31,20.73 79.05,19.48 79.05,5 75.84,1.79 67.62,1.79 65.47,3.93 53.68,3.93 P_BUTTON.2
RPI_RX
  Top 0.152: RPI5.10 38.67,53.79 38.67,52.9 39.74,51.82 39.74,40.03 37.42,37.71 37.42,35.74 46.35,26.8 46.35,23.77 47.24,22.87 57.79,22.87 58.86,21.8 U$1.17-A3/TX4/SDA1
RPI_TX
  Bottom 0.152: RPI5.8 35.99,53.79 35.99,52.72 34.74,51.47 34.74,50.93 27.41,43.6 24.19,43.6 23.48,42.89 23.48,42.17 27.59,38.06 39.02,38.06 40.1,36.99 40.1,36.45 52.07,24.48 53.68,24.48 56.36,21.8 U$1.16-A2/RX4/SCL1
V_DIV
  Top 0.152: R1.3 28.12,28.77 29.02,28.77 35.99,21.8 U$1.38-A14/CS/IN1

### Text on the board
tPlace: Main Board Mk 2, V1.0 / June 2024 | ⏚ | ⏚ | ⏚ | VCC_CONV | VOLT_DIV | ⏚ | ⏚ | ⏚ | ⏚ | + | + | ⏚